# EAGLE design midi-switcher (EAGLE 6.6.0)
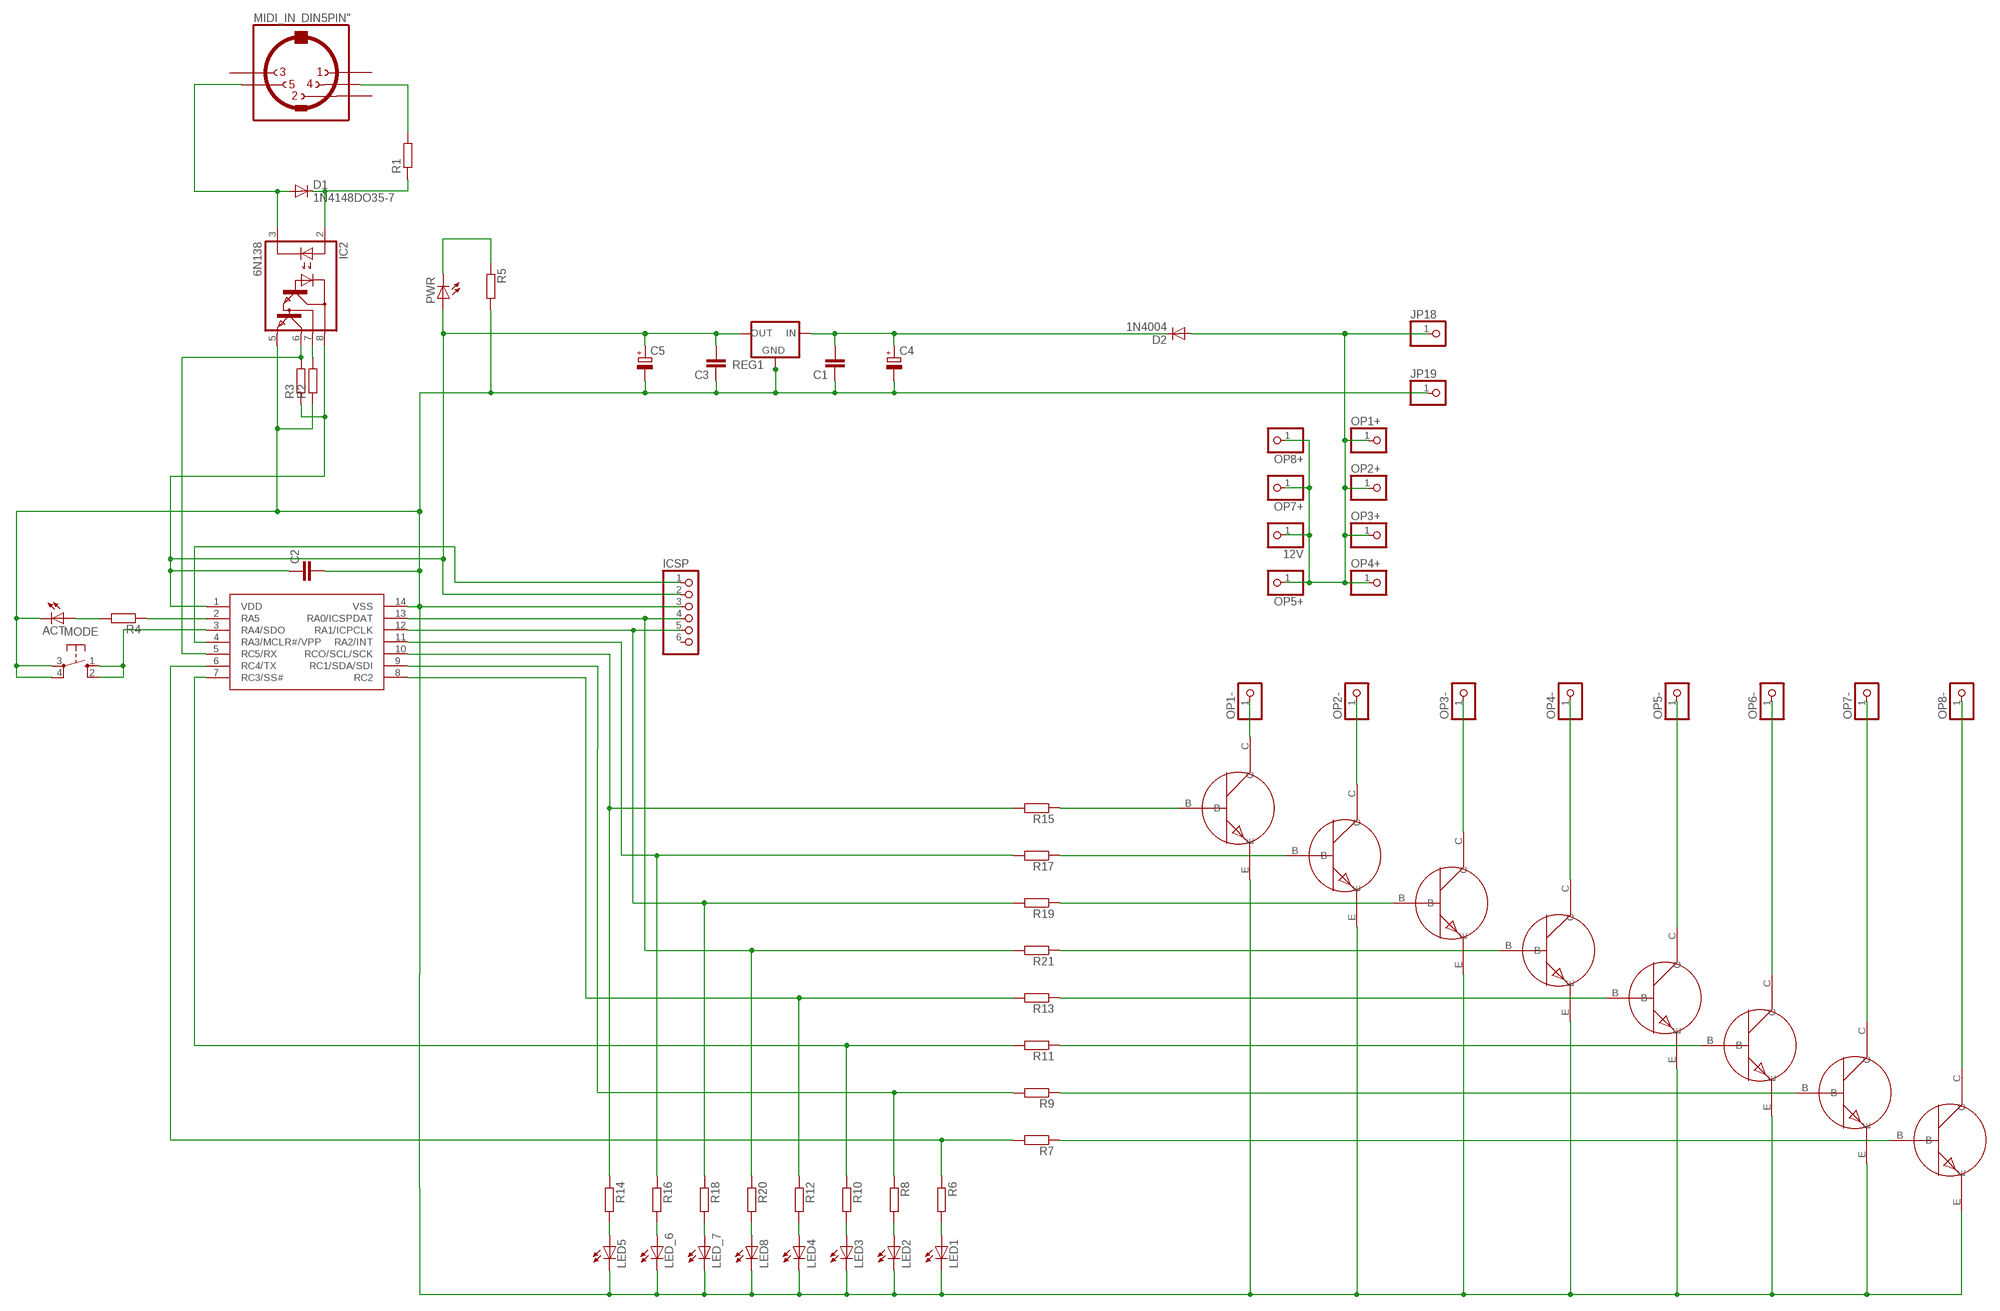
[diagram p0: schematic, sheet 1]

## Parts
12V  PINHD-1X1  [1X01]
ACT  LED3MM  [LED3MM]
C1  C-EU025-025X050  [C025-025X050]
C2  C-EU025-025X050  [C025-025X050]
C3  C-EU025-025X050  [C025-025X050]
C4  CPOL-EUE2.5-7  [E2,5-7]
C5  CPOL-EUE2.5-7  [E2,5-7]
D1  1N4148DO35-7  [DO35-7]
D2  1N4004  [DO41-10]
IC1  PIC16F1825DIL14  [DIL14]
IC2  6N138  [DIL08]
ICSP  HEADER-1X6  [1X06_OVAL]
JP18  PINHD-1X1  [1X01]
JP19  PINHD-1X1  [1X01]
LED1  LED3MM  [LED3MM]
LED2  LED3MM  [LED3MM]
LED3  LED3MM  [LED3MM]
LED4  LED3MM  [LED3MM]
LED5  LED3MM  [LED3MM]
LED8  LED3MM  [LED3MM]
LED_6  LED3MM  [LED3MM]
LED_7  LED3MM  [LED3MM]
MIDI_IN  DIN5PIN"  [TRUCONN90]
MODE  10-XX  [B3F-10XX]
OP1+  PINHD-1X1  [1X01]
OP1-  PINHD-1X1  [1X01]
OP2+  PINHD-1X1  [1X01]
OP2-  PINHD-1X1  [1X01]
OP3+  PINHD-1X1  [1X01]
OP3-  PINHD-1X1  [1X01]
OP4+  PINHD-1X1  [1X01]
OP4-  PINHD-1X1  [1X01]
OP5+  PINHD-1X1  [1X01]
OP5-  PINHD-1X1  [1X01]
OP6-  PINHD-1X1  [1X01]
OP7+  PINHD-1X1  [1X01]
OP7-  PINHD-1X1  [1X01]
OP8+  PINHD-1X1  [1X01]
OP8-  PINHD-1X1  [1X01]
PWR  LED3MM  [LED3MM]
R1  R-EU_0207/7  [0207/7]
R2  R-EU_0207/7  [0207/7]
R3  R-EU_0207/7  [0207/7]
R4  R-EU_0207/7  [0207/7]
R5  R-EU_0207/7  [0207/7]
R6  R-EU_0207/7  [0207/7]
R7  R-EU_0207/7  [0207/7]
R8  R-EU_0207/7  [0207/7]
R9  R-EU_0207/7  [0207/7]
R10  R-EU_0207/7  [0207/7]
R11  R-EU_0207/7  [0207/7]
R12  R-EU_0207/7  [0207/7]
R13  R-EU_0207/7  [0207/7]
R14  R-EU_0207/7  [0207/7]
R15  R-EU_0207/7  [0207/7]
R16  R-EU_0207/7  [0207/7]
R17  R-EU_0207/7  [0207/7]
R18  R-EU_0207/7  [0207/7]
R19  R-EU_0207/7  [0207/7]
R20  R-EU_0207/7  [0207/7]
R21  R-EU_0207/7  [0207/7]
REG1  78XXS  [78XXS]
U$1  TIP120  [TIP120]
U$2  TIP120  [TIP120]
U$3  TIP120  [TIP120]
U$4  TIP120  [TIP120]
U$5  TIP120  [TIP120]
U$6  TIP120  [TIP120]
U$7  TIP120  [TIP120]
U$8  TIP120  [TIP120]

## Nets
12V: 12V.1 D2.A JP18.1 OP1+.1 OP2+.1 OP3+.1 OP4+.1 OP5+.1 OP7+.1 OP8+.1
GND: ACT.K(C) C1.1 C2.2 C3.1 C4.- C5.- IC1.14(VSS) IC2.5(GND) ICSP.3 JP19.1 LED1.K(C) LED2.K(C) LED3.K(C) LED4.K(C) LED5.K(C) LED8.K(C) LED_6.K(C) LED_7.K(C) MODE.3(P) MODE.4(P1) R2.1 R5.2 REG1.GND U$1.E U$2.E U$3.E U$4.E U$5.E U$6.E U$7.E U$8.E
N$1: MIDI_IN.4 R1.2
N$2: D1.C IC2.2(A) R1.1
N$3: D1.A IC2.3(C) MIDI_IN.5
N$4: IC2.7(VB) R2.2
N$5: ACT.A R4.2
N$6: LED5.A R14.2
N$7: LED_6.A R16.2
N$8: R15.1 U$1.B
N$9: R17.1 U$2.B
N$10: R19.1 U$4.B
N$11: R21.1 U$3.B
N$12: R13.1 U$5.B
N$13: R11.1 U$6.B
N$14: R9.1 U$7.B
N$15: R7.1 U$8.B
N$16: IC1.5(RC5/RX) IC2.6(VO) R3.2
N$17: IC1.2(RA5) R4.1
N$18: IC1.12(RA1/ICPCLK) ICSP.5 R18.1 R19.2
N$19: IC1.13(RA0/ICSPDAT) ICSP.4 R20.1 R21.2
N$20: IC1.8(RC2) R12.1 R13.2
N$21: IC1.7(RC3/SS#) R10.1 R11.2
N$22: IC1.9(RC1/SDA/SDI) R8.1 R9.2
N$23: IC1.6(RC4/TX) R6.1 R7.2
N$24: LED_7.A R18.2
N$25: OP1-.1 U$1.C
N$26: OP2-.1 U$2.C
N$27: OP3-.1 U$4.C
N$29: OP5-.1 U$5.C
N$30: OP6-.1 U$6.C
N$31: OP4-.1 U$3.C
N$33: LED8.A R20.2
N$34: IC1.4(RA3/MCLR#/VPP) ICSP.1
N$35: LED4.A R12.2
N$36: LED3.A R10.2
N$37: LED2.A R8.2
N$38: LED1.A R6.2
N$39: C1.2 C4.+ D2.C REG1.IN
N$41: PWR.K(C) R5.1
N$42: OP7-.1 U$7.C
N$44: IC1.3(RA4/SDO) MODE.1(S) MODE.2(S1)
N$45: IC1.11(RA2/INT) R16.1 R17.2
N$46: IC1.10(RCO/SCL/SCK) R14.1 R15.2
N$47: OP8-.1 U$8.C
VDD: C2.1 C3.2 C5.+ IC1.1(VDD) IC2.8(VCC) ICSP.2 PWR.A R3.1 REG1.OUT
Unconnected: ICSP.6 MIDI_IN.1 MIDI_IN.2 MIDI_IN.3

## Library data of the parts
12V JP18 JP19 OP1+ OP1- OP2+ OP2- OP3+ OP3- OP4+ OP4- OP5+ OP5- OP6- OP7+ OP7- OP8+ OP8- = adafruit:PINHD-1X1: Pin header 1x1 for 0.1" spacing With round pins
ACT LED1-LED5 LED8 LED_6 LED_7 PWR = adafruit:LED: LED OSRAM: - CHIPLED LG R971, LG N971, LY N971, LG Q971, LY Q971, LO R971, LY R971 LH N974, LH R974 LS Q976, LO Q976, LY Q976 LO Q996 - Hyper CHIPLED LW Q18S LB Q993, LB Q99A, LB R99A - SideLED LS A670, LO A670, LY A670, LG A670, LP A670 LB A673, LV A673, LT A673, LW A673 LH A674 LY A675 LS A676, LA A676, LO A676, LY A676, LW A676 LS A679, LY A679, LG A679 - Hyper Micro SIDELED® LS Y876, LA Y876, LO Y876, LY Y876 LT Y87S - SmartLED LW L88C, LW L88S LB L89C, LB L89S, LG L890 LS L89K, LO L89K, LY L89K LS L896, LA L896, LO L896, LY L896 - TOPLED LS T670, LO T670, LY T670, LG T670, LP T670 LSG T670, LSP T670, LSY T670, LOP T670, LYG T670 LG T671, LOG T671, LSG T671 LB T673, LV T673, LT T673, LW T673 LH T674 LS T676, LA T676, LO T676, LY T676, LB T676, LH T676, LSB T676, LW T676 LB T67C, LV T67C, LT T67C, LS T67K, LO T67K, LY T67K, LW E67C LS E67B, LA E67B, LO E67B, LY E67B, LB E67C, LV E67C, LT E67C LW T67C LS T679, LY T679, LG T679 LS T770, LO T770, LY T770, LG T770, LP T770 LB T773, LV T773, LT T773, LW T773 LH T774 LS E675, LA E675, LY E675, LS T675 LS T776, LA T776, LO T776, LY T776, LB T776 LHGB T686 LT T68C, LB T68C - Hyper Mini TOPLED® LB M676 - Mini TOPLED Santana® LG M470 LS M47K, LO M47K, LY M47K Source: http://www.osram.convergy.de/
C1-C3 = rcl:C-EU: CAPACITOR, European symbol
C4 C5 = rcl:CPOL-EU: POLARIZED CAPACITOR, European symbol
D1 = diode:1N4148: DIODE high speed (Philips)
D2 = adafruit:1N4004: DIODE General purpose 1N400x type rectifier (With bigger pads) http://www.ladyada.net/library/pcb/eaglelibrary.html
IC1 = jasons_stuff:PIC16F1825
IC2 = optocoupler:6N138: MOTOROLA OPTO COUPLER
ICSP = microbuilder:HEADER-1X6: PIN HEADER
MIDI_IN = jasons_stuff:DIN5PIN: Female CONNECTOR 5 pins 90 deg. with shield, horizontal (DIN 41524)
MODE = switch-omron:10-XX: OMRON SWITCH
R1-R21 = rcl:R-EU_: RESISTOR, European symbol
REG1 = v-reg:78XXS: VOLTAGE REGULATOR
U$1-U$8 = jasons_stuff:TIP120

## Board
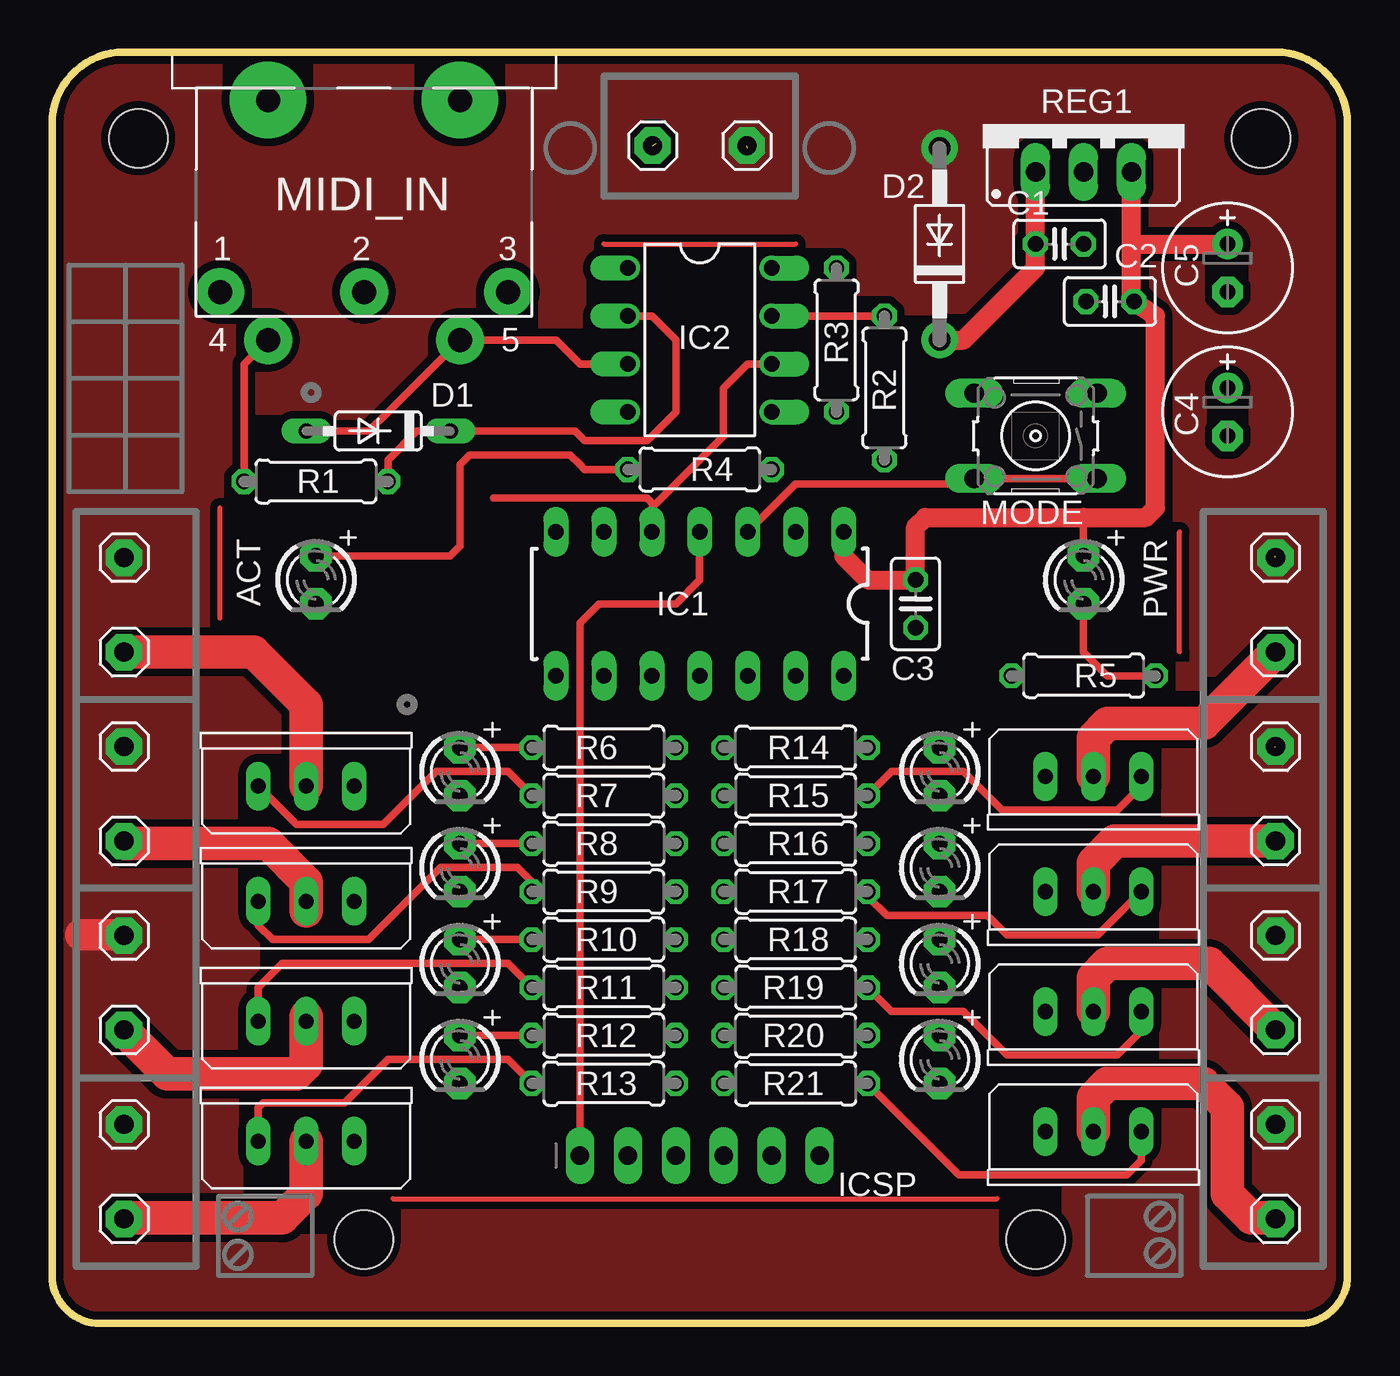
[diagram p1: board, top side]
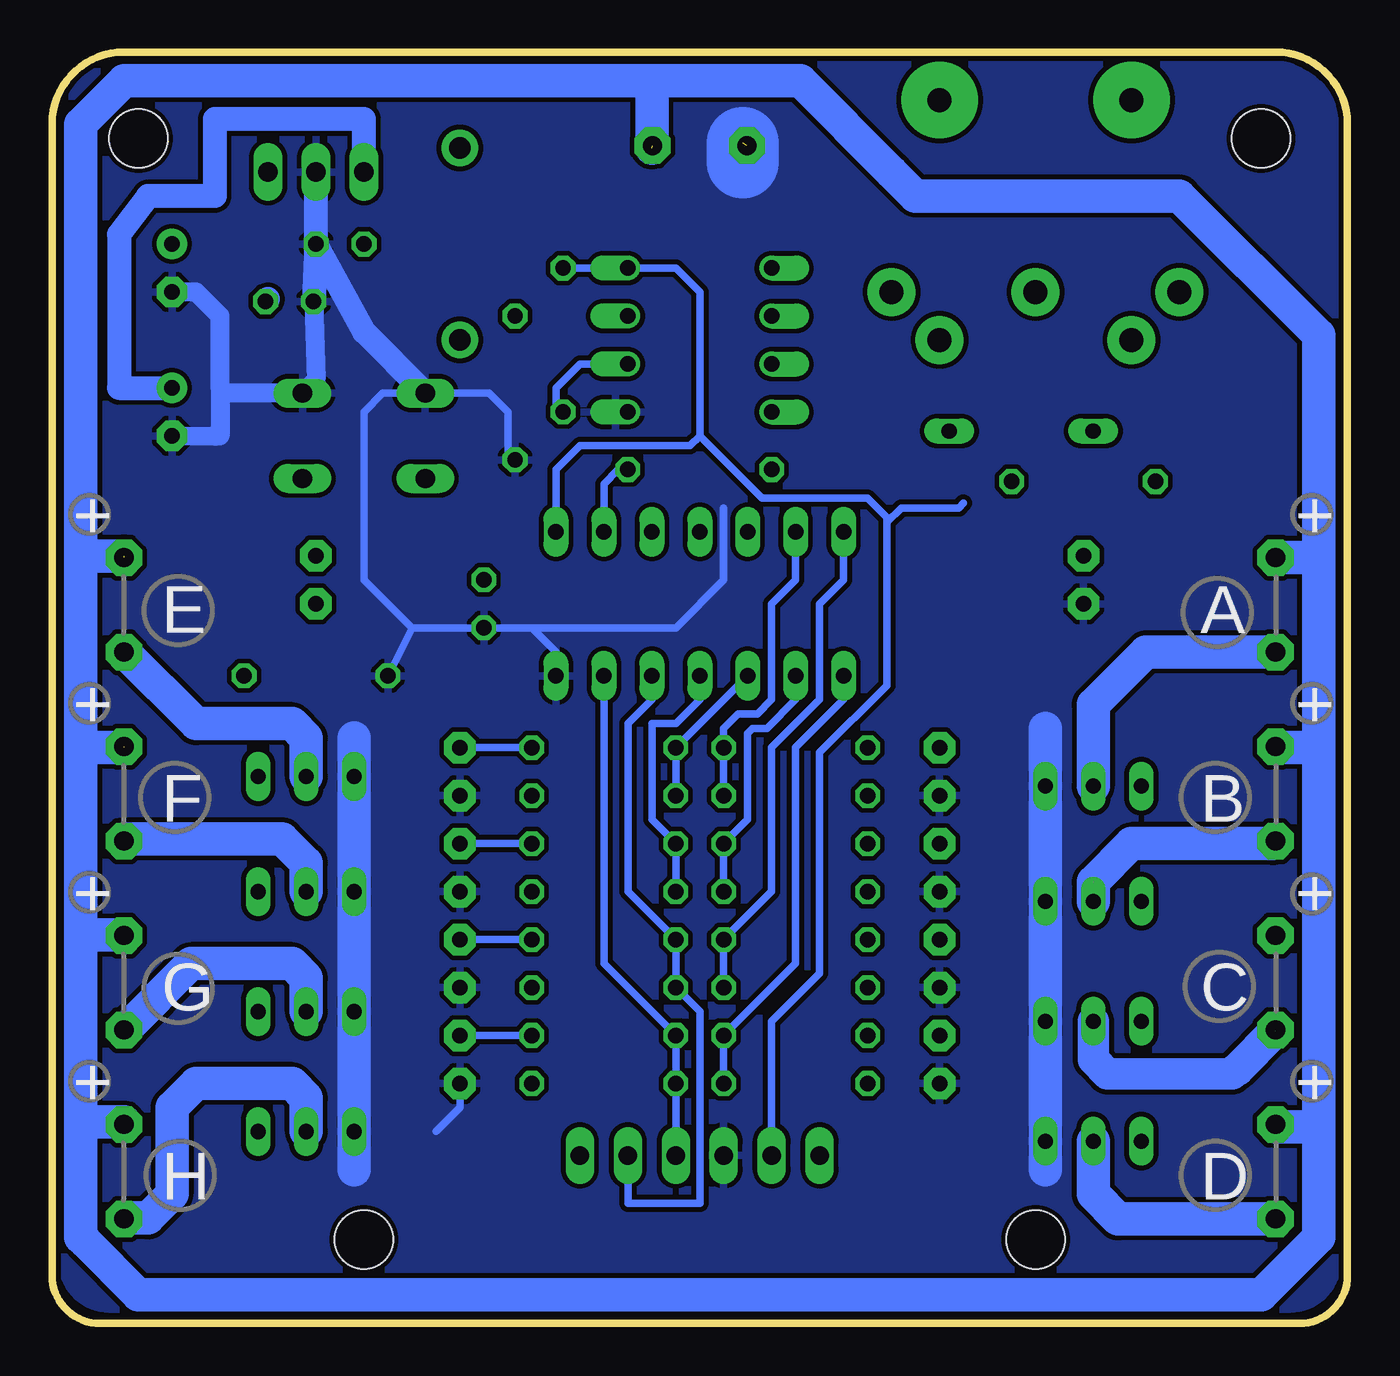
[diagram p2: board, bottom side, seen from below]

Size 68.58 x 67.31 mm. Coordinates in mm from the lower left corner, seen from the top.
Outline: 0,6.35 0,1.78
Outline: 0,6.35 0,2.54 arc90 2.54,0 66.04,0 arc90 68.58,2.54 68.58,63.5 arc90 64.77,67.31 3.81,67.31 arc90 0,63.5 0,6.35
Copper layers (1*16): Top 0.035mm / dielectric 1.5mm / Bottom 0.035mm
Design rules "ITEADstudio_DRC": minimum track width 6mil, minimum drill 12mil, track to track 6mil, track to pad 6mil, pad to pad 6mil, via to via 6mil, smd to smd 0mil, copper to edge 10mil, drill to drill 10mil, minimum pad ring 10mil, minimum via ring 6mil, stop-mask expansion 2mil, vias tented up to drill 100mil, thermal gap 10mil
Holes 3.1 mm at 4.57,62.74 64.01,62.74 16.51,4.45 52.07,4.45

### Footprints (pad centres in the part's own frame; a part is rotated, then mirrored left to right if it is on the bottom)
1X01 = drill 1.016 pad 1.93 octagon: 1 0,0
LED3MM = drill 0.813 pad 1.676 octagon: A -1.27,0; K 1.27,0
C025-025X050 = drill 0.813 octagon: 1 -1.27,0; 2 1.27,0
E2,5-7 = drill 0.813 pad 1.6: + -1.27,0 | drill 0.813 pad 1.6 octagon: - 1.27,0
DO35-7 = drill 0.813 long: A 3.81,0; C -3.81,0
DO41-10 = drill 1.118 pad 1.93: A 5.08,0; C -5.08,0
DIL14 = drill 0.813 long: 1 -8.89,-3.81; 2 -6.35,-3.81; 3 -3.81,-3.81; 4 -1.27,-3.81; 5 1.27,-3.81; 6 3.81,-3.81; 7 6.35,-3.81; 8 6.35,3.81; 9 3.81,3.81; 10 1.27,3.81; 11 -1.27,3.81; 12 -3.81,3.81; 13 -6.35,3.81; 14 -8.89,3.81
DIL08 = drill 0.813 offset: 1 -3.81,-3.81; 2 -1.27,-3.81; 3 1.27,-3.81; 4 3.81,-3.81; 5 3.81,3.81; 6 1.27,3.81; 7 -1.27,3.81; 8 -3.81,3.81
1X06_OVAL = drill 1 long: 1 -6.35,0; 2 -3.81,0; 3 -1.27,0; 4 1.27,0; 5 3.81,0; 6 6.35,0
TRUCONN90 = drill 1.27 pad 2.54: 1 7.62,5.08; 2 0,5.08; 3 -7.62,5.08; 4 5.08,7.62; 5 -5.08,7.62 | drill 1.27 pad 4.064: NC -5.08,-5.08; NC@ 5.08,-5.08
B3F-10XX = drill 1.016 long: 1 -3.251,2.261; 2 3.251,2.261; 3 -3.251,-2.261; 4 3.251,-2.261
0207/7 = drill 0.813 octagon: 1 -3.81,0; 2 3.81,0
78XXS = drill 1.016 long: GND 0,-2.54; IN -2.54,-2.54; OUT 2.54,-2.54
TIP120 = drill 0.8 long: B 0,2.54; C 0,0; E 0,-2.54

### Placement (x,y rotation side)
12V  3.81,20.54 0 top
ACT  13.97,39.37 270 top
C1  53.34,57.15 180 top
C2  56.01,54.1 180 top
C3  45.72,38.1 90 top
C4  62.23,48.26 270 top
C5  62.23,55.88 270 top
D1  17.27,47.24 180 top
D2  46.99,57.15 90 top
IC1  33.02,38.1 180 top
IC2  34.29,52.07 270 top
ICSP  34.29,8.89 0 top
JP18  36.79,62.36 0 top
JP19  31.79,62.36 0 top
LED1  21.59,29.21 270 top
LED2  21.59,24.13 270 top
LED3  21.59,19.05 270 top
LED4  21.59,13.97 270 top
LED5  46.99,29.21 270 top
LED8  46.99,13.97 270 top
LED_6  46.99,24.13 270 top
LED_7  46.99,19.05 270 top
MIDI_IN  16.51,59.69 180 top
MODE  52.07,46.99 180 top
OP1+  64.77,40.54 0 top
OP1-  64.77,35.54 0 top
OP2+  64.77,30.54 0 top
OP2-  64.77,25.54 0 top
OP3+  64.77,20.54 0 top
OP3-  64.77,15.54 0 top
OP4+  64.77,10.54 0 top
OP4-  64.77,5.54 0 top
OP5+  3.81,10.54 0 top
OP5-  3.81,5.54 0 top
OP6-  3.81,15.54 0 top
OP7+  3.81,30.54 0 top
OP7-  3.81,25.54 0 top
OP8+  3.81,40.54 0 top
OP8-  3.81,35.54 0 top
PWR  54.61,39.37 270 top
R1  13.97,44.58 180 top
R2  44.07,49.53 90 top
R3  41.53,52.07 270 top
R4  34.29,45.21 180 top
R5  54.61,34.29 180 top
R6  29.21,30.48 180 top
R7  29.21,27.94 0 top
R8  29.21,25.4 180 top
R9  29.21,22.86 0 top
R10  29.21,20.32 180 top
R11  29.21,17.78 0 top
R12  29.21,15.24 180 top
R13  29.21,12.7 0 top
R14  39.37,30.48 0 top
R15  39.37,27.94 180 top
R16  39.37,25.4 0 top
R17  39.37,22.86 180 top
R18  39.37,20.32 0 top
R19  39.37,17.78 180 top
R20  39.37,15.24 0 top
R21  39.37,12.7 180 top
REG1  54.61,63.5 0 top
U$1  55.12,28.96 270 top
U$2  55.12,22.86 270 top
U$3  55.12,10.16 270 top
U$4  55.12,16.51 270 top
U$5  13.46,9.65 90 top
U$6  13.46,16 90 top
U$7  13.46,22.35 90 top
U$8  13.46,28.45 90 top

### Tracks (layer width: path | path; a pad name or v marks a point on that pad's centre or on a via)
12V  (3 unrouted)
  Top 1.676: 1.52,20.57 3.81,20.57
  Bottom 1.778: 36.83,62.23 36.83,65.53 | 1.52,10.41 1.52,4.57 4.57,1.52 64.01,1.52 66.8,4.32 | 1.52,10.41 1.52,30.48 | 1.52,30.48 1.52,40.64 | 1.52,40.64 1.52,52.32 8.89,59.69 22.86,59.69 24.13,60.96 28.96,65.79 64.77,65.79 67.06,63.5 67.06,41.4 | 67.06,41.4 67.06,20.57 | 67.06,20.57 67.06,10.67 | 67.06,10.67 67.06,4.57 | 67.06,41.4 67.06,41.66 | OP8+.1 1.62,40.54 1.52,40.64 | 1.52,30.48 3.81,30.48 | 1.52,10.41 3.81,10.41 | 67.06,20.57 64.77,20.57 | 67.06,10.67 64.77,10.67 | 64.77,30.48 66.8,30.48 | 66.8,40.64 64.77,40.64
  pour Top (isolate 0.406, no thermals): -2.54,68.58 -2.54,-2.54 72.39,-2.54 72.39,69.85 -1.27,69.85
GND  (1 unrouted)
  Bottom 0.406: IC1.14 41.91,35.56 43.18,36.83 | 43.18,36.83 C3.1 49.53,36.83 | 49.53,36.83 R5.2 | LED8.K 46.99,11.43 48.26,10.16 | 43.18,36.83 35.56,36.83 33.02,39.37 33.02,43.18 | R2.1 44.45,45.85 44.45,48.26 45.44,49.25 MODE.4 51.08,49.25 52.07,48.26 52.07,39.37 49.53,36.83
  Bottom 1.016: C5.- 60.96,54.61 59.69,53.34 59.69,49.53 | C4.- 59.93,46.95 59.69,46.99 59.69,49.53 | C2.2 54.61,49.96 MODE.3 59.41,49.25 59.69,49.53
  Bottom 1.27: C1.1 52.07,52.5 MODE.4 | C1.1 C2.2 | C1.1 REG1.GND
  Bottom 1.778: 16,8.13 16,31.5 | 52.58,8.13 52.58,30.99
  Bottom 3.81: 32,61.47 32,62.48
  pour Bottom (isolate 0.254): 0,62.23 arc-90 4.57,66.8 6.35,66.8 64.52,66.8 arc-90 68.07,63.25 68.07,61.21 68.07,3.3 arc-90 65.53,0.76 59.69,0.76 3.05,0.76 arc-90 0.51,3.3 0.51,3.56 arc-90 0,4.06
N$1
  Top 0.406: R1.2 10.16,50.8 MIDI_IN.4
N$2
  Top 0.406: R1.1 17.78,45.72 19.3,47.24 D1.C 27.69,47.24 28.19,46.74 31.5,46.74 31.75,46.99 33.02,48.26 33.02,52.07 31.75,53.34 IC2.2
N$3
  Top 0.406: IC2.3 27.94,50.8 26.67,52.07 MIDI_IN.5 20.32,50.8 17.78,48.26 16.76,47.24 D1.A
N$4
  Top 0.406: IC2.7 R2.2
N$5
  Top 0.406: ACT.A 15.75,40.64 21.08,40.64 21.59,41.15 21.59,45.47 22.1,45.97 27.43,45.97 27.94,45.47 28.19,45.21 R4.2
N$6
  Bottom 0.406: R14.2 LED5.A
N$7
  Bottom 0.406: R16.2 LED_6.A
N$8
  Top 0.406: U$1.B 57.66,28.45 56.39,27.18 50.29,27.18 48.26,29.21 44.45,29.21 R15.1
N$9
  Top 0.406: R17.1 43.18,22.61 44.2,21.59 49.53,21.59 50.55,20.57 55.37,20.57 U$2.B
N$10
  Top 0.406: U$4.B 57.66,15.49 56.39,14.22 52.58,14.22 50.55,14.22 50.29,14.48 48.26,16.51 44.45,16.51 R19.1
N$11
  Top 0.406: U$3.B 57.66,8.64 56.9,7.87 48.01,7.87 R21.1
N$12
  Top 0.406: U$5.B 10.92,11.43 11.18,11.68 15.49,11.68 17.78,13.97 24.13,13.97 R13.1
N$13
  Top 0.406: R11.1 24.13,19.05 19.81,19.05 12.19,19.05 10.92,17.78 U$6.B
N$14
  Top 0.406: R9.1 25.4,23.37 24.64,24.13 20.57,24.13 16.76,20.32 11.68,20.32 10.92,21.08 U$7.B
N$15
  Top 0.406: U$8.B 12.95,26.42 17.53,26.42 20.32,29.21 24.13,29.21 R7.1
N$16
  Top 0.406: IC1.5 31.75,43.18 31.88,43.31 | 31.88,43.31 35.56,46.99 35.56,49.53 36.83,50.8 IC2.6 | 31.88,43.31 31.5,43.69 23.88,43.69 23.37,43.69
  Bottom 0.406: IC2.6 40.64,50.8 41.91,49.53 41.91,48.39 R3.2
N$17
  Bottom 0.406: 39.37,43.18 IC1.2 39.37,44.45 38.61,45.21 R4.1
N$18
  Bottom 0.406: IC1.12 36.83,33.02 38.1,31.75 38.1,22.86 R18.1 R19.2 34.29,16.51 34.29,6.35 38.1,6.35 ICSP.5
N$19
  Bottom 0.406: ICSP.4 R21.2 R20.1 39.37,19.05 IC1.13
N$20
  Bottom 0.406: R13.2 R12.1 29.21,19.05 29.21,30.48 26.67,33.02 IC1.8
N$21
  Bottom 0.406: R11.2 R10.1 30.48,22.86 30.48,30.48 27.94,33.02 27.94,38.1 26.67,39.37 IC1.7
N$22
  Bottom 0.406: R9.2 R8.1 31.75,26.67 31.75,31.24 31.5,31.5 30.73,31.5 29.21,33.02 IC1.9
N$23
  Bottom 0.406: R7.2 R6.1 33.02,31.5 32.26,32.26 31.24,32.26 30.48,33.02 30.48,38.1 29.21,39.37 IC1.6
N$24
  Bottom 0.406: R18.2 LED_7.A
N$25
  Top 1.778: U$1.C 55.12,30.99 55.88,31.75 60.98,31.75 OP1-.1
  Bottom 1.778: U$1.C 55.12,30.99 55.88,31.75 60.96,31.75 64.77,35.56
N$26
  Top 1.778: OP2-.1 56.27,25.54 55.12,24.38 U$2.C
  Bottom 1.778: U$2.C 55.12,24.38 56.39,25.65 64.77,25.65
N$27
  Top 1.778: U$4.C 55.12,18.29 55.88,19.05 61.26,19.05 OP3-.1
  Bottom 1.778: U$4.C 55.12,18.29 55.88,19.05 61.21,19.05 64.77,15.49
N$28
  Top 0.254: 29.21,57.15 39.37,57.15
N$29
  Top 1.778: U$5.C 13.46,6.86 12.19,5.59 3.81,5.59
  Bottom 1.778: OP5-.1 12.14,5.54 13.46,6.86 U$5.C
N$30  (1 unrouted)
  Top 1.778: 3.81,15.49 6.1,13.21 11.43,13.21 12.95,13.21 13.46,13.72 13.46,15.75 | 13.46,15.75 13.46,16.26 | 13.46,15.75 13.46,15.24
  Bottom 1.676: 5.84,13.46 6.1,13.21 12.7,13.21 13.46,13.97 U$6.C
  Bottom 1.778: OP6-.1 3.81,15.49 5.84,13.46
N$31
  Top 1.778: U$3.C 55.12,11.94 55.88,12.7 60.96,12.7 62.23,11.43 62.23,6.86 63.5,5.59 64.72,5.59 OP4-.1
  Bottom 1.778: U$3.C 55.12,11.94 55.88,12.7 60.96,12.7 62.23,11.43 62.23,6.86 63.5,5.59 64.77,5.59
N$32
  Top 0.254: 8.89,37.34 8.89,43.18
N$33
  Bottom 0.406: R20.2 LED8.A
N$34
  Top 0.406: IC1.4 34.29,39.37 33.02,38.1 28.96,38.1 27.94,37.08 27.94,30.48 ICSP.1
N$35
  Top 0.406: LED4.A R12.2
N$36
  Top 0.406: LED3.A R10.2
N$37
  Top 0.406: LED2.A R8.2
N$38
  Top 0.406: LED1.A R6.2
N$39
  Top 1.016: REG1.IN C1.2 52.07,55.88 48.26,52.07 D2.C
  Bottom 1.27: REG1.IN 52.07,63.75 59.96,63.75 59.96,59.69 63.5,59.69 65.02,57.66 65.02,49.53 C4.+
N$40
  Top 0.254: 18.03,6.6 50.04,6.6
N$41
  Top 0.406: PWR.K 54.61,35.56 55.88,34.29 R5.1
N$42  (1 unrouted)
  Top 1.778: 3.81,25.4 11.43,25.4 13.46,23.37 13.46,21.84
  Bottom 1.778: U$7.C 13.46,23.37 11.43,25.4 3.95,25.4 OP7-.1
N$43
  Top 0.254: 59.69,35.56 59.69,41.91
N$44
  Top 0.406: MODE.1 MODE.2 48.54,44.73 48.26,44.45 39.37,44.45 IC1.3
N$45
  Bottom 0.406: R17.2 R16.1 36.83,26.67 36.83,31.75 35.56,31.75 34.29,33.02 IC1.11
N$46
  Bottom 0.406: R15.2 R14.1 IC1.10
N$47
  Top 1.778: 3.81,35.56 10.67,35.56 13.46,32.77 U$8.C
  Bottom 1.778: U$8.C 13.46,32.77 10.67,35.56 3.83,35.56 OP8-.1
VDD
  Top 0.406: 54.61,42.67 PWR.A
  Top 1.016: IC1.1 41.91,40.64 43.18,39.37 C3.2 45.72,42.16 46.23,42.67 54.61,42.67 57.91,42.67 58.42,43.18 58.42,53.34 C2.1 57.15,54.23 57.15,57.15 | 57.15,57.15 REG1.OUT | 57.15,57.15 C5.+
  Bottom 0.406: ICSP.2 30.48,16 27.94,18.54 27.94,30.23 24.38,33.78 24.38,39.37 | 24.38,39.37 24.38,40.64 | 24.38,40.64 24.38,42.42 | 24.38,42.42 24.38,42.67 25.4,43.69 30.99,43.69 34.29,46.99 | R3.1 IC2.8 35.56,55.88 34.29,54.61 34.29,52.07 34.29,46.99 | IC1.1 41.91,45.21 40.64,46.48 34.8,46.48 34.29,46.99 | 24.38,39.37 24.38,40.64 | 20.32,43.43 20.57,43.18 23.62,43.18 24.38,42.42
  Bottom 1.27: C2.1 57.15,54.23

### Text on the board
bNames: + | + | A | E | + | + | B | F | + | + | C | G | + | + | D | H
tDocu: DC-IN | - | + | ports | A | E | B | F | C | G | D | H | hotchk155 | hotchk155 | PORTE | PORTA | PORTF | PORTB | PORTG | PORTC | LED1 | LED5 | PORTH | -LED4 | -LED8 | 1 | PORTD | + | + | - | - | rev 5
bDocu: SET | YOUR | MIDI | FREE